# EAGLE schematic luci2_device (EAGLE 6.3)
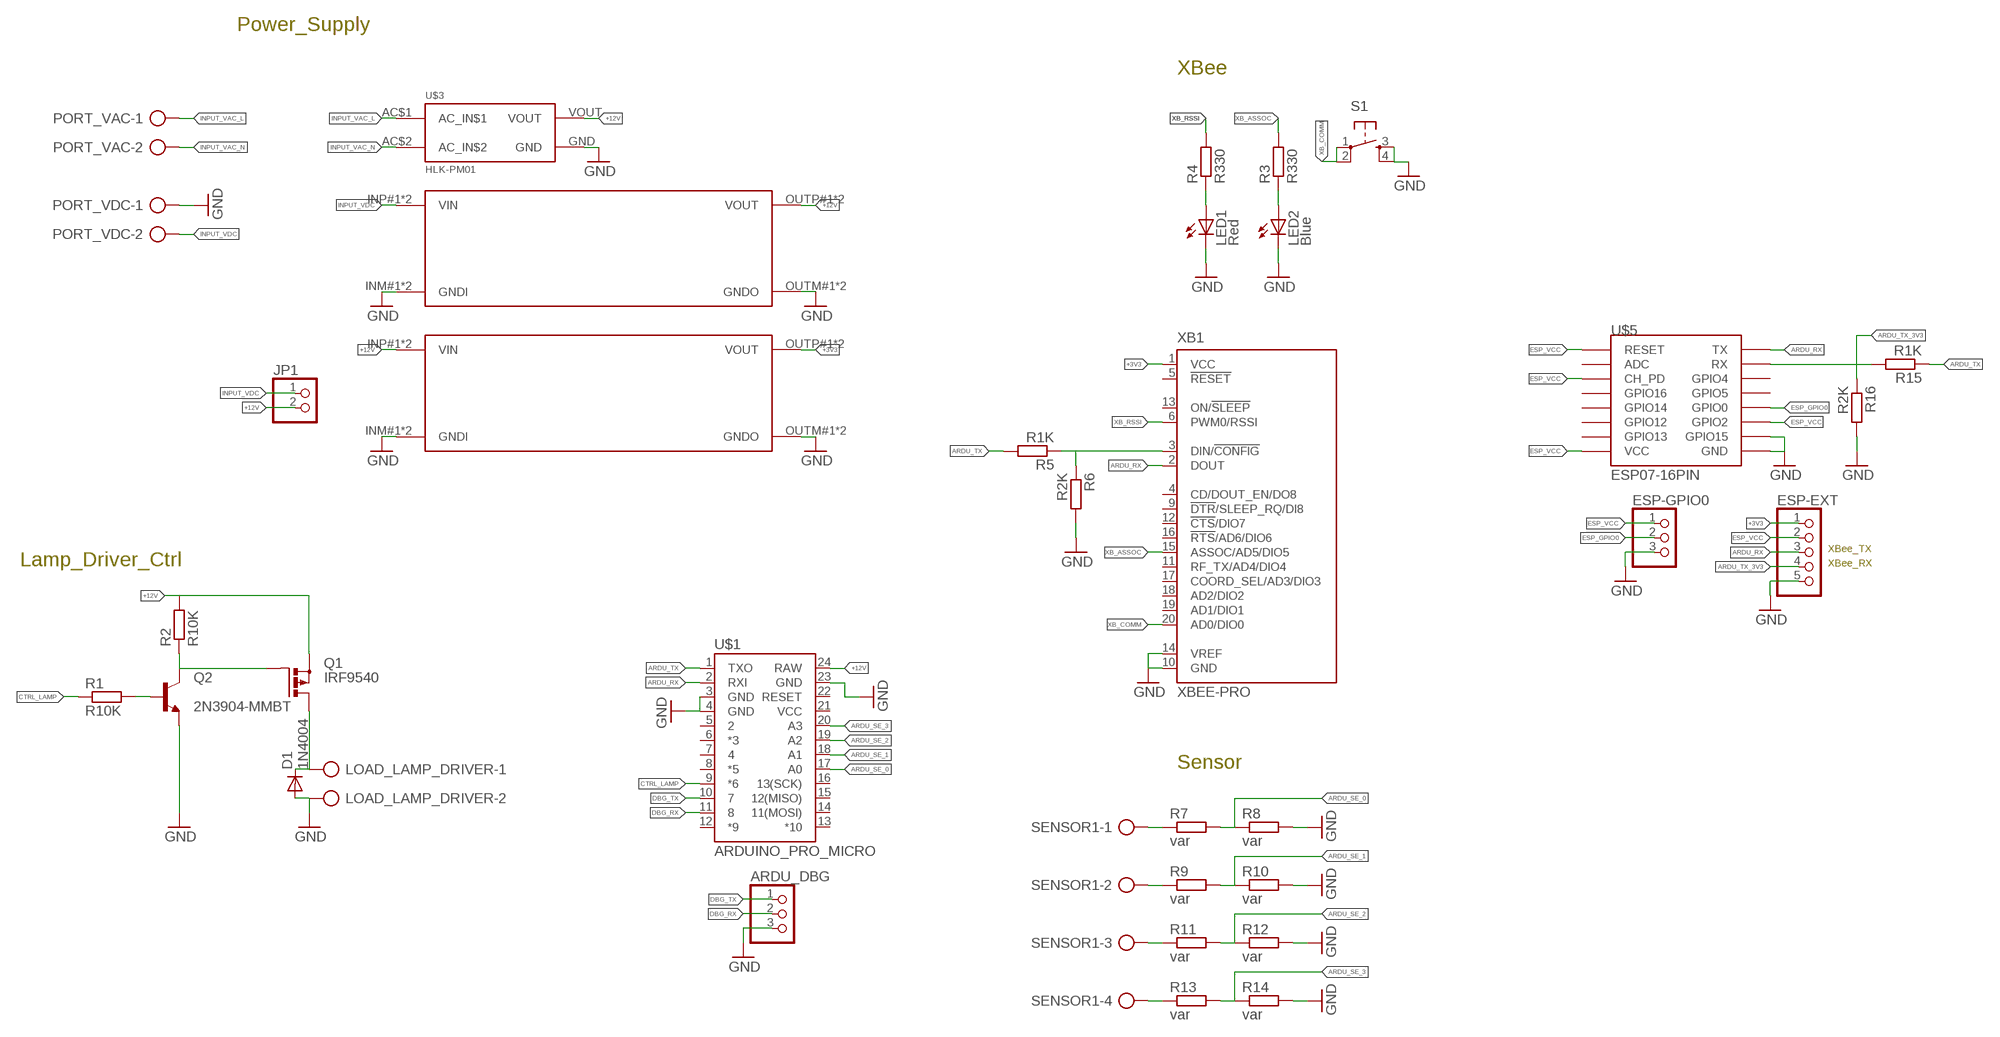
[diagram p0: schematic, sheet 1]

## Parts
ARDU_DBG  HEADER-1X3ROUND  [1X03_ROUND]
D1  1N4004  [DO41-10]
ESP-EXT  HEADER-1X5ROUND  [1X05_ROUND]
ESP-GPIO0  HEADER-1X3ROUND  [1X03_ROUND]
JP1  HEADER-1X2ROUND  [1X02_ROUND]
LED1  Red  LEDCHIPLED_0805  [CHIPLED_0805]
LED2  Blue  LEDCHIPLED_0805  [CHIPLED_0805]
LOAD_LAMP_DRIVER  AK300/2  [AK300/2]
PORT_VAC  AK300/2  [AK300/2]
PORT_VDC  AK300/2  [AK300/2]
Q1  IRF9540  PMOSFET_PTO220BV  [TO220BV]
Q2  2N3904-MMBT  [SOT23]
R1  R10K  R-EU_M0805  [M0805]
R2  R10K  R-EU_M0805  [M0805]
R3  R330  R-EU_M0805  [M0805]
R4  R330  R-EU_M0805  [M0805]
R5  R1K  R-EU_M0805  [M0805]
R6  R2K  R-EU_M0805  [M0805]
R7  var  R-EU_M0805  [M0805]
R8  var  R-EU_M0805  [M0805]
R9  var  R-EU_M0805  [M0805]
R10  var  R-EU_M0805  [M0805]
R11  var  R-EU_M0805  [M0805]
R12  var  R-EU_M0805  [M0805]
R13  var  R-EU_M0805  [M0805]
R14  var  R-EU_M0805  [M0805]
R15  R1K  R-EU_M0805  [M0805]
R16  R2K  R-EU_M0805  [M0805]
S1  TAC_SWITCHPTH  [TACTILE-PTH]
SENSOR1  AK300/4  [AK300/4]
U$1  ARDUINO_PRO_MICRO  [ARDUINO_PRO_MICRO]
U$2  DCDCMODULE_SMALL  [DCDCMODULE-SMALL]
U$3  HLK-PM01  [HLK-PM01]
U$4  DCDCMODULE_SMALL  [DCDCMODULE-SMALL]
U$5  ESP07-16PIN  [ESP07-16PIN]
XB1  XBEE-PRO  [XBEE-PRO]

## Nets
+3V3: ESP-EXT.1 U$2.OUTP#1(VOUT) U$2.OUTP#2(VOUT) XB1.1(VCC)
+12V: JP1.2 Q1.S R2.2 U$1.24(RAW) U$2.INP#1(VIN) U$2.INP#2(VIN) U$3.VOUT U$4.OUTP#1(VOUT) U$4.OUTP#2(VOUT)
ARDU_RX: ESP-EXT.3 U$1.2(RXI) U$5.TX XB1.2(DOUT)
ARDU_SE_0: R7.2 R8.1 U$1.17(A0)
ARDU_SE_1: R9.2 R10.1 U$1.18(A1)
ARDU_SE_2: R11.2 R12.1 U$1.19(A2)
ARDU_SE_3: R13.2 R14.1 U$1.20(A3)
ARDU_TX: R5.2 R15.1 U$1.1(TXO)
ARDU_TX_3V3: ESP-EXT.4 R15.2 R16.1 U$5.RX
CTRL_LAMP: R1.1 U$1.9(*6)
DBG_RX: ARDU_DBG.2 U$1.11
DBG_TX: ARDU_DBG.1 U$1.10
ESP_GPIO0: ESP-GPIO0.2 U$5.GPIO0
ESP_VCC: ESP-EXT.2 ESP-GPIO0.1 U$5.CH_PD U$5.GPIO2 U$5.REST(RESET) U$5.VCC
GND: ARDU_DBG.3 D1.A ESP-EXT.5 ESP-GPIO0.3 LED1.C LED2.C LOAD_LAMP_DRIVER.2 PORT_VDC.1 Q2.2(E) R6.2 R8.2 R10.2 R12.2 R14.2 R16.2 S1.3 S1.4 U$1.3(GND) U$1.4(GND) U$1.23(GND) U$2.INM#1(GNDI) U$2.INM#2(GNDI) U$2.OUTM#1(GNDO) U$2.OUTM#2(GNDO) U$3.GND U$4.INM#1(GNDI) U$4.INM#2(GNDI) U$4.OUTM#1(GNDO) U$4.OUTM#2(GNDO) U$5.GND U$5.GPIO15 XB1.10(GND) XB1.14(VREF)
INPUT_VAC_L: PORT_VAC.1 U$3.AC$1(AC_IN$1)
INPUT_VAC_N: PORT_VAC.2 U$3.AC$2(AC_IN$2)
INPUT_VDC: JP1.1 PORT_VDC.2 U$4.INP#1(VIN) U$4.INP#2(VIN)
N$1: D1.C LOAD_LAMP_DRIVER.1 Q1.D
N$2: Q1.G Q2.3(C) R2.1
N$3: LED1.A R4.1
N$4: Q2.1(B) R1.2
N$5: LED2.A R3.1
N$6: R5.1 R6.1 XB1.3(DIN/!CONFIG)
N$8: R7.1 SENSOR1.1
N$10: R9.1 SENSOR1.2
N$12: R11.1 SENSOR1.3
N$14: R13.1 SENSOR1.4
XB_ASSOC: R3.2 XB1.15(ASSOC/AD5/DIO5)
XB_COMM: S1.1 S1.2 XB1.20(AD0/DIO0)
XB_RSSI: R4.2 XB1.6(PWM0/RSSI)
Unconnected: U$1.5 U$1.6(*3) U$1.7 U$1.8(*5) U$1.12(*9) U$1.13(*10) U$1.14(11(MOSI)) U$1.15(12(MISO)) U$1.16(13(SCK)) U$1.21(VCC) U$1.22(RESET) U$5.ADC U$5.GPIO4 U$5.GPIO5 U$5.GPIO12 U$5.GPIO13 U$5.GPIO14 U$5.GPIO16 XB1.4(CD/DOUT_EN/DO8) XB1.5(!RESET) XB1.9(!DTR!/SLEEP_RQ/DI8) XB1.11(RF_TX/AD4/DIO4) XB1.12(!CTS!/DIO7) XB1.13(ON/!SLEEP) XB1.16(!RTS!/AD6/DIO6) XB1.17(COORD_SEL/AD3/DIO3) XB1.18(AD2/DIO2) XB1.19(AD1/DIO1)

## Notes on the sheet
- Power_Supply
- XBee
- XBee_TX
- Lamp_Driver_Ctrl | XBee_RX
- Sensor

## Library data of the parts
ARDU_DBG ESP-GPIO0 = microbuilder:HEADER-1X3: PIN HEADER
D1 = diode:1N4004: DIODE general purpose rectifier, 1 A
ESP-EXT = microbuilder:HEADER-1X5: PIN HEADER
JP1 = microbuilder:HEADER-1X2: PIN HEADER
LED1 LED2 = adafruit:LED: LED OSRAM: - CHIPLED LG R971, LG N971, LY N971, LG Q971, LY Q971, LO R971, LY R971 LH N974, LH R974 LS Q976, LO Q976, LY Q976 LO Q996 - Hyper CHIPLED LW Q18S LB Q993, LB Q99A, LB R99A - SideLED LS A670, LO A670, LY A670, LG A670, LP A670 LB A673, LV A673, LT A673, LW A673 LH A674 LY A675 LS A676, LA A676, LO A676, LY A676, LW A676 LS A679, LY A679, LG A679 - Hyper Micro SIDELED® LS Y876, LA Y876, LO Y876, LY Y876 LT Y87S - SmartLED LW L88C, LW L88S LB L89C, LB L89S, LG L890 LS L89K, LO L89K, LY L89K LS L896, LA L896, LO L896, LY L896 - TOPLED LS T670, LO T670, LY T670, LG T670, LP T670 LSG T670, LSP T670, LSY T670, LOP T670, LYG T670 LG T671, LOG T671, LSG T671 LB T673, LV T673, LT T673, LW T673 LH T674 LS T676, LA T676, LO T676, LY T676, LB T676, LH T676, LSB T676, LW T676 LB T67C, LV T67C, LT T67C, LS T67K, LO T67K, LY T67K, LW E67C LS E67B, LA E67B, LO E67B, LY E67B, LB E67C, LV E67C, LT E67C LW T67C LS T679, LY T679, LG T679 LS T770, LO T770, LY T770, LG T770, LP T770 LB T773, LV T773, LT T773, LW T773 LH T774 LS E675, LA E675, LY E675, LS T675 LS T776, LA T776, LO T776, LY T776, LB T776 LHGB T686 LT T68C, LB T68C - Hyper Mini TOPLED® LB M676 - Mini TOPLED Santana® LG M470 LS M47K, LO M47K, LY M47K Source: http://www.osram.convergy.de/
LOAD_LAMP_DRIVER PORT_VAC PORT_VDC = con-ptr500:AK300/2: CONNECTOR; OC_FARNELL: unknown; OC_NEWARK: unknown
Q1 = transistor-power:PMOSFET_P: Power MOSFET P-Channel
Q2 = m-pad-2.1:2N3904: NPN TRANSISTOR
R1-R16 = resistor:R-EU_: RESISTOR, European symbol
S1 = SparkFun-Electromechanical:TAC_SWITCH: Momentary Switch Button commonly used for reset or general input. Spark Fun Electronics SKU : COM-00097 SMT- SWCH-08247
SENSOR1 = con-ptr500:AK300/4: CONNECTOR; OC_FARNELL: unknown; OC_NEWARK: unknown
U$1 = SparkFun-Boards:ARDUINO_PRO_MICRO
U$2 U$4 = bontor:DCDCMODULE_SMALL
U$3 = bontor:HLK-PM01
U$5 = esp8266modules:ESP07-16PIN: ESP8266 Wifi module 07 - 16 pins; DIMENSIONS: 22.0 x 16.0 mm; PINS: 16; PITCH: 0.078" / 2 mm
XB1 = microbuilder:XBEE: XBee (TM) /XBee-PRO(TM) OEM RF Modules Source: MaxStream, Inc. xbee_productmanual.pdf